# EAGLE design Projet Elec Groupe 8 (EAGLE 9.3.0)
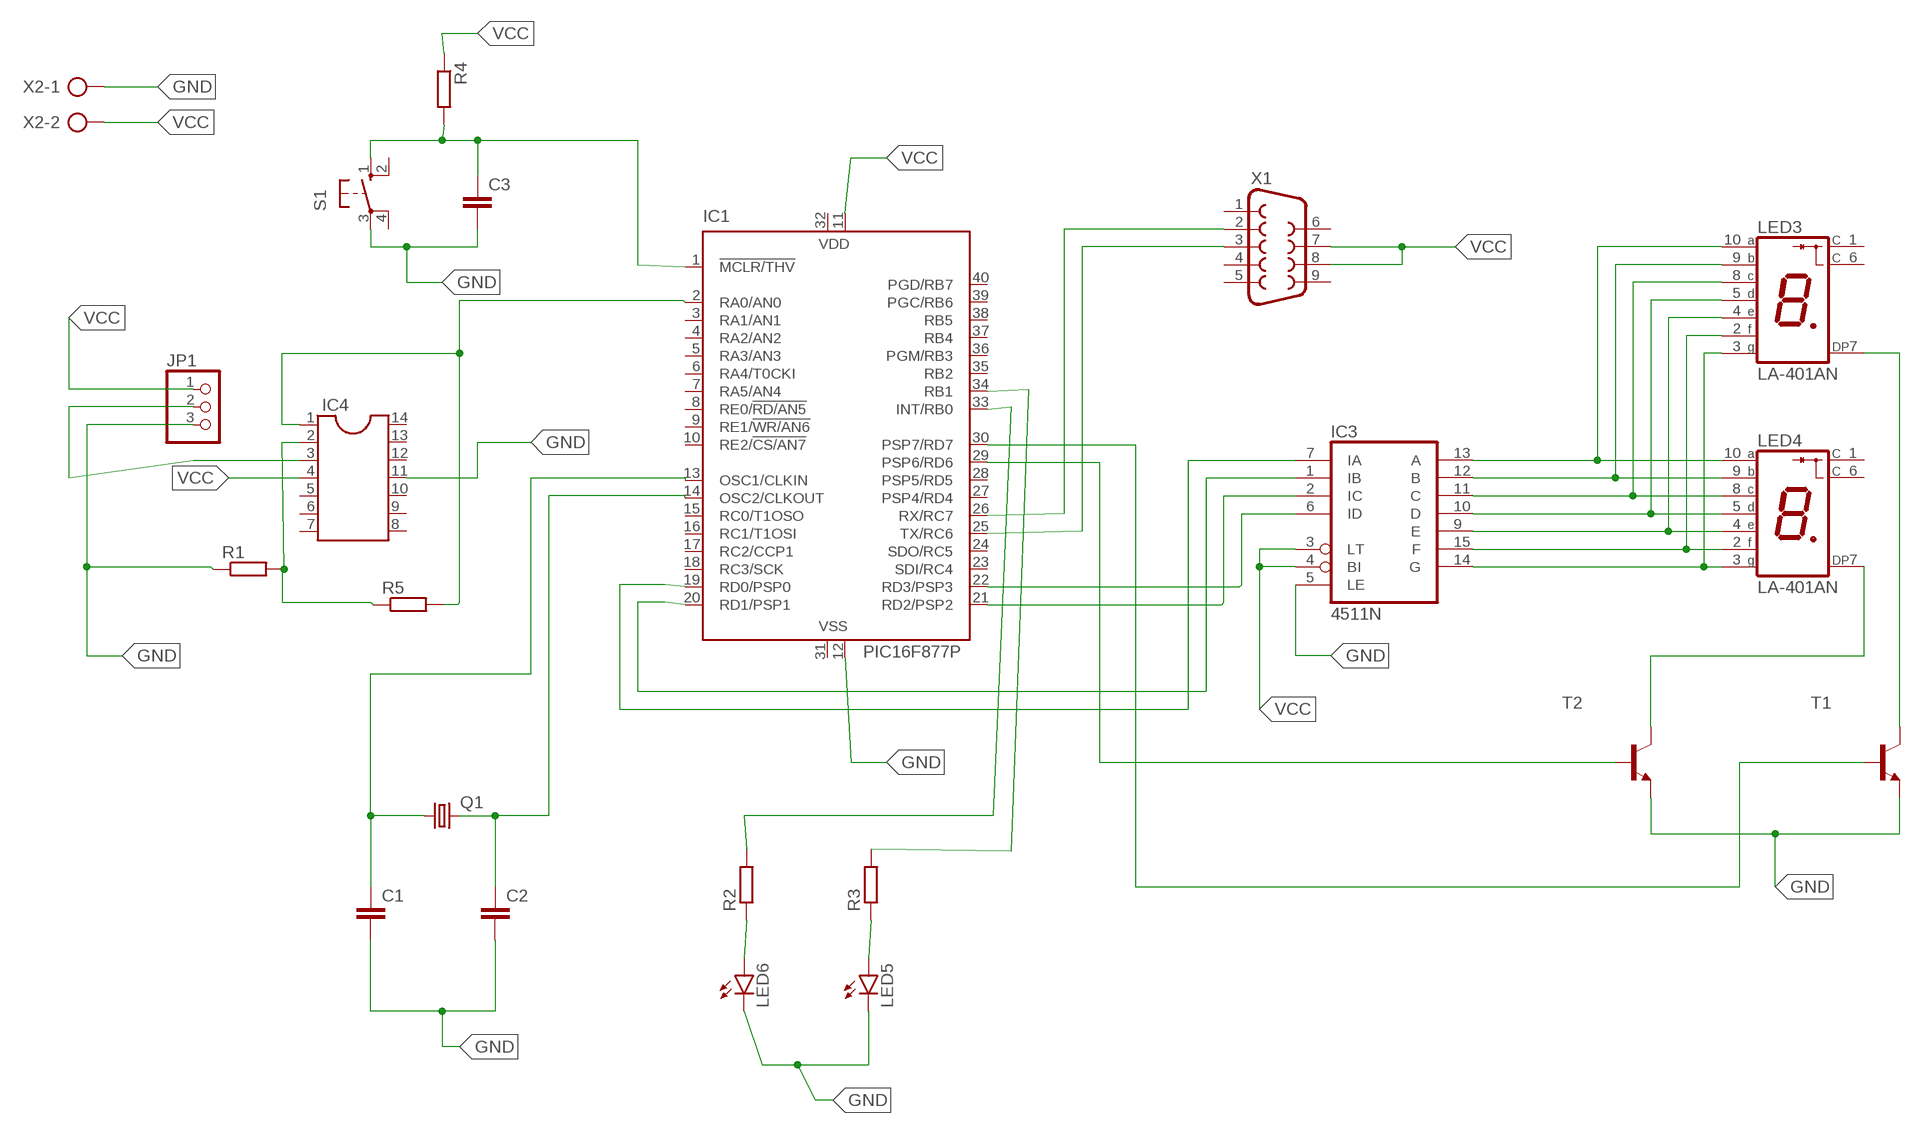
[diagram p0: schematic, sheet 1]

## Parts
C1  C-EU025-025X050  [C025-025X050]
C2  C-EU025-025X050  [C025-025X050]
C3  C-EU025-025X050  [C025-025X050]
IC1  PIC16F877P  [DIL40]
IC3  4511N  [DIL16]
IC4  DIL14  [DIL14]
JP1  PINHD-1X3  [1X03]
LED3  LA-401AN  [LA-401]
LED4  LA-401AN  [LA-401]
LED5  LEDLD260  [LD260]
LED6  LEDLD260  [LD260]
Q1  CRYSTALHC18U-V  [HC18U-V]
R1  R-EU_0204/5  [0204/5]
R2  R-EU_0204/5  [0204/5]
R3  R-EU_0204/5  [0204/5]
R4  R-EU_0204/5  [0204/5]
R5  R-EU_0204/5  [0204/5]
S1  10-XX  [B3F-10XX]
T1  -NPN-TO92-EBC  [TO92-EBC]
T2  -NPN-TO92-EBC  [TO92-EBC]
X1  F09V  [F09V]
X2  AK300/2  [AK300/2]

## Nets
GND: C1.2 C2.2 C3.2 IC1.12(VSS) IC3.5(LE) IC4.11 JP1.3 LED5.K(C) LED6.K(C) R1.1 S1.3(P) T1.E T2.E X2.1
N$1: IC1.30(PSP7/RD7) T1.B
N$2: IC1.29(PSP6/RD6) T2.B
N$3: IC3.13(A) LED3.10(A) LED4.10(A)
N$4: IC3.12(B) LED3.9(B) LED4.9(B)
N$5: IC3.11(C) LED3.8(C) LED4.8(C)
N$6: IC3.10(D) LED3.5(D) LED4.5(D)
N$7: IC3.9(E) LED3.4(E) LED4.4(E)
N$8: IC3.15(F) LED3.2(F) LED4.2(F)
N$9: IC3.14(G) LED3.3(G) LED4.3(G)
N$10: LED4.7(DP) T2.C
N$11: LED3.7(DP) T1.C
N$12: C1.1 IC1.13(OSC1/CLKIN) Q1.1
N$13: C2.1 IC1.14(OSC2/CLKOUT) Q1.2
N$14: LED6.A R2.1
N$15: LED5.A R3.1
N$16: IC1.26(RX/RC7) X1.2
N$17: IC1.19(RD0/PSP0) IC3.7(IA)
N$18: IC1.20(RD1/PSP1) IC3.1(IB)
N$19: IC1.21(RD2/PSP2) IC3.2(IC)
N$20: IC1.22(RD3/PSP3) IC3.6(ID)
N$21: C3.1 IC1.1(!MCLR/THV) R4.2 S1.1(S)
N$22: IC4.3 JP1.2
N$23: IC4.2 R1.2 R5.1
N$24: IC1.2(RA0/AN0) IC4.1 R5.2
N$25: IC1.25(TX/RC6) X1.3
N$26: IC1.33(INT/RB0) R2.2
N$27: IC1.34(RB1) R3.2
VCC: IC1.11(VDD) IC3.3(LT) IC3.4(BI) IC4.4 JP1.1 R4.1 X1.7 X1.8 X2.2
Unconnected: IC1.3(RA1/AN1) IC1.4(RA2/AN2) IC1.5(RA3/AN3) IC1.6(RA4/T0CKI) IC1.7(RA5/AN4) IC1.8(RE0/!RD/AN5) IC1.9(RE1/!WR/AN6) IC1.10(RE2/!CS/AN7) IC1.15(RC0/T1OSO) IC1.16(RC1/T1OSI) IC1.17(RC2/CCP1) IC1.18(RC3/SCK) IC1.23(SDI/RC4) IC1.24(SDO/RC5) IC1.27(PSP4/RD4) IC1.28(PSP5/RD5) IC1.35(RB2) IC1.36(PGM/RB3) IC1.37(RB4) IC1.38(RB5) IC1.39(PGC/RB6) IC1.40(PGD/RB7) IC4.5 IC4.6 IC4.7 IC4.8 IC4.9 IC4.10 IC4.12 IC4.13 IC4.14 LED3.1(C) LED3.6(C) LED4.1(C) LED4.6(C) S1.2(S1) S1.4(P1) X1.1 X1.4 X1.5 X1.6 X1.9

## Power pins joined to a net without a drawn wire
VDD: IC1.32(VDD) IC3.16(VDD)
VSS: IC1.31(VSS) IC3.8(VSS)

## Library data of the parts
C1-C3 = rcl:C-EU: CAPACITOR, European symbol; SPICEPREFIX: C
IC1 = microchip:PIC16F87*: MICROCONTROLLER; MF: MICROCHIP; MPN: PIC16F877-04/P; OC_FARNELL: 9761349; OC_NEWARK: 61K3463
IC3 = 45xx:4511: BCD to 7-segment LATCH/DECODER/DRIVER
IC4 = ic-package:DIL14: Dual In Line / Socket
JP1 = pinhead:PINHD-1X3: PIN HEADER
LED3 LED4 = led-7-segment:LA-401*N: Single Digit LED Numeric Display (cathode common) Source: ROHM .. la-1401dn.pdf; OC_FARNELL: unknown; OC_NEWARK: unknown
LED5 LED6 = led:LED: LED OSRAM: - CHIPLED LG R971, LG N971, LY N971, LG Q971, LY Q971, LO R971, LY R971 LH N974, LH R974 LS Q976, LO Q976, LY Q976 LO Q996 - Hyper CHIPLED LW Q18S LB Q993, LB Q99A, LB R99A - SideLED LS A670, LO A670, LY A670, LG A670, LP A670 LB A673, LV A673, LT A673, LW A673 LH A674 LY A675 LS A676, LA A676, LO A676, LY A676, LW A676 LS A679, LY A679, LG A679 - Hyper Micro SIDELED® LS Y876, LA Y876, LO Y876, LY Y876 LT Y87S - SmartLED LW L88C, LW L88S LB L89C, LB L89S, LG L890 LS L89K, LO L89K, LY L89K LS L896, LA L896, LO L896, LY L896 - TOPLED LS T670, LO T670, LY T670, LG T670, LP T670 LSG T670, LSP T670, LSY T670, LOP T670, LYG T670 LG T671, LOG T671, LSG T671 LB T673, LV T673, LT T673, LW T673 LH T674 LS T676, LA T676, LO T676, LY T676, LB T676, LH T676, LSB T676, LW T676 LB T67C, LV T67C, LT T67C, LS T67K, LO T67K, LY T67K, LW E67C LS E67B, LA E67B, LO E67B, LY E67B, LB E67C, LV E67C, LT E67C LW T67C LS T679, LY T679, LG T679 LS T770, LO T770, LY T770, LG T770, LP T770 LB T773, LV T773, LT T773, LW T773 LH T774 LS E675, LA E675, LY E675, LS T675 LS T776, LA T776, LO T776, LY T776, LB T776 LHGB T686 LT T68C, LB T68C - Hyper Mini TOPLED® LB M676 - Mini TOPLED Santana® LG M470 LS M47K, LO M47K, LY M47K Source: http://www.osram.convergy.de LUXEON: - LUMILED® LXK2-PW12-R00, LXK2-PW12-S00, LXK2-PW14-U00, LXK2-PW14-V00 LXK2-PM12-R00, LXK2-PM12-S00, LXK2-PM14-U00 LXK2-PE12-Q00, LXK2-PE12-R00, LXK2-PE12-S00, LXK2-PE14-T00, LXK2-PE14-U00 LXK2-PB12-K00, LXK2-PB12-L00, LXK2-PB12-M00, LXK2-PB14-N00, LXK2-PB14-P00, LXK2-PB14-Q00 LXK2-PR12-L00, LXK2-PR12-M00, LXK2-PR14-Q00, LXK2-PR14-R00 LXK2-PD12-Q00, LXK2-PD12-R00, LXK2-PD12-S00 LXK2-PH12-R00, LXK2-PH12-S00 LXK2-PL12-P00, LXK2-PL12-Q00, LXK2-PL12-R00 Source: www.luxeon.com KINGBRIGHT: KA-3528ASYC Source: www.kingbright.com
Q1 = crystal:CRYSTAL: CRYSTAL; OC_FARNELL: unknown; OC_NEWARK: unknown
R1-R5 = rcl:R-EU_: RESISTOR, European symbol; SPICEPREFIX: R
S1 = switch-omron:10-XX: OMRON SWITCH; MPN: B3F-1000; OC_FARNELL: 176432; OC_NEWARK: 36M3542
T1 T2 = transistor:*-NPN-: NPN Transistror BF959 corrected 2008.03.06
X1 = con-subd:F09: SUB-D; OC_FARNELL: unknown; OC_NEWARK: unknown
X2 = con-ptr500:AK300/2: CONNECTOR; OC_FARNELL: unknown; OC_NEWARK: unknown

## Board
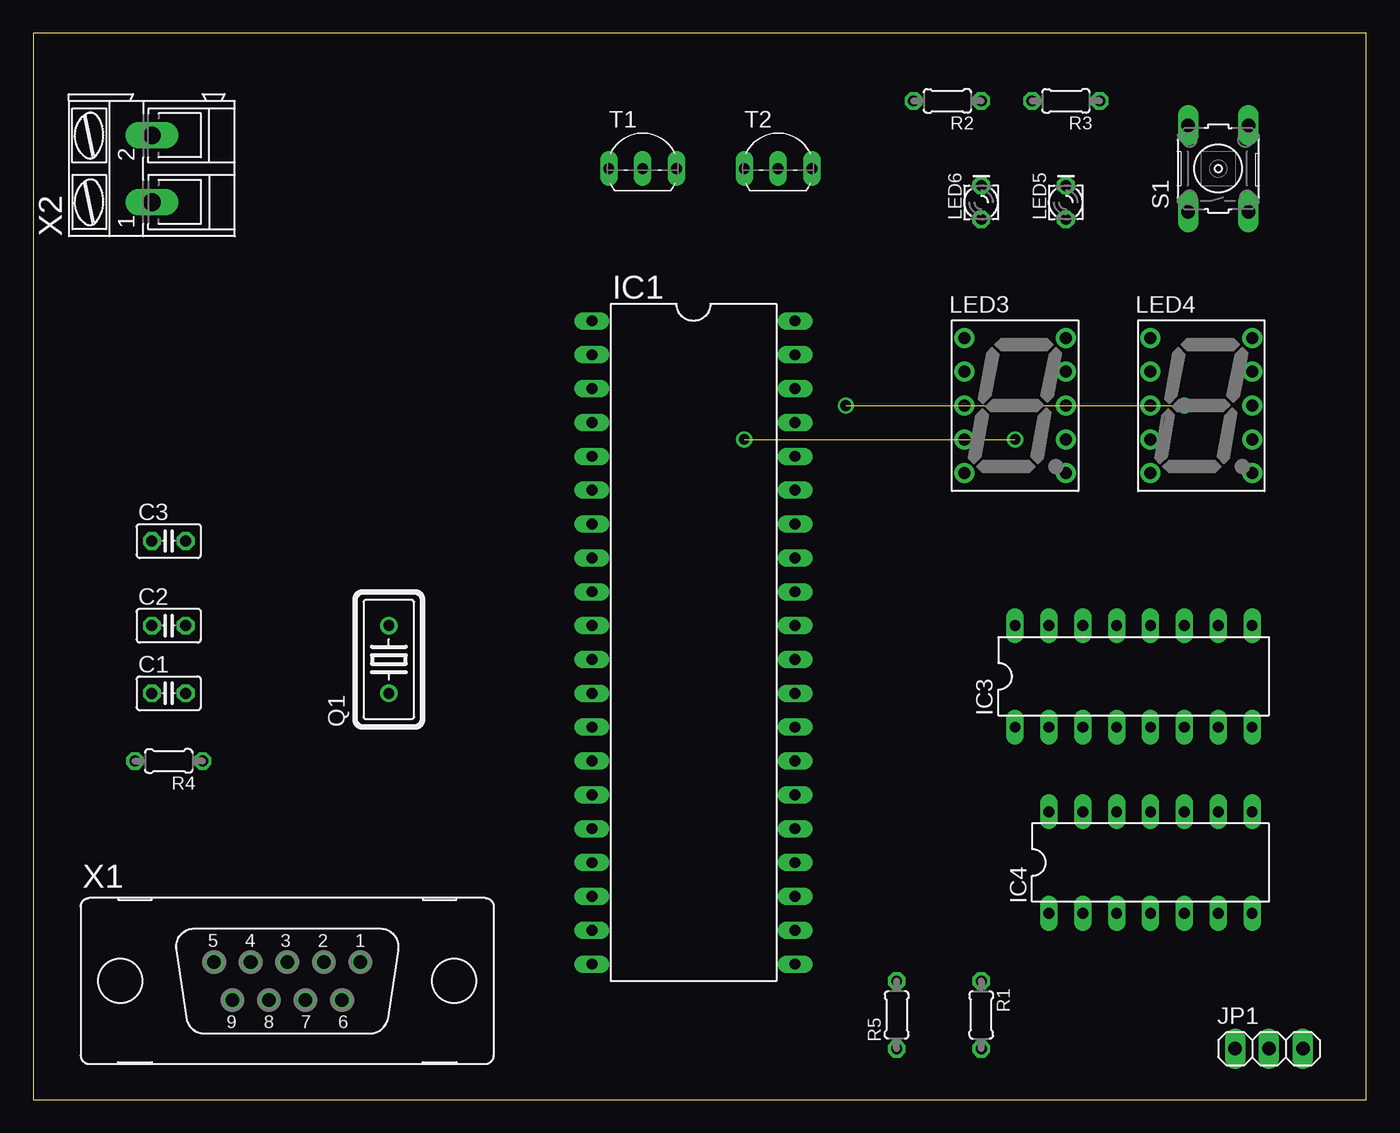
[diagram p1: board, top side]
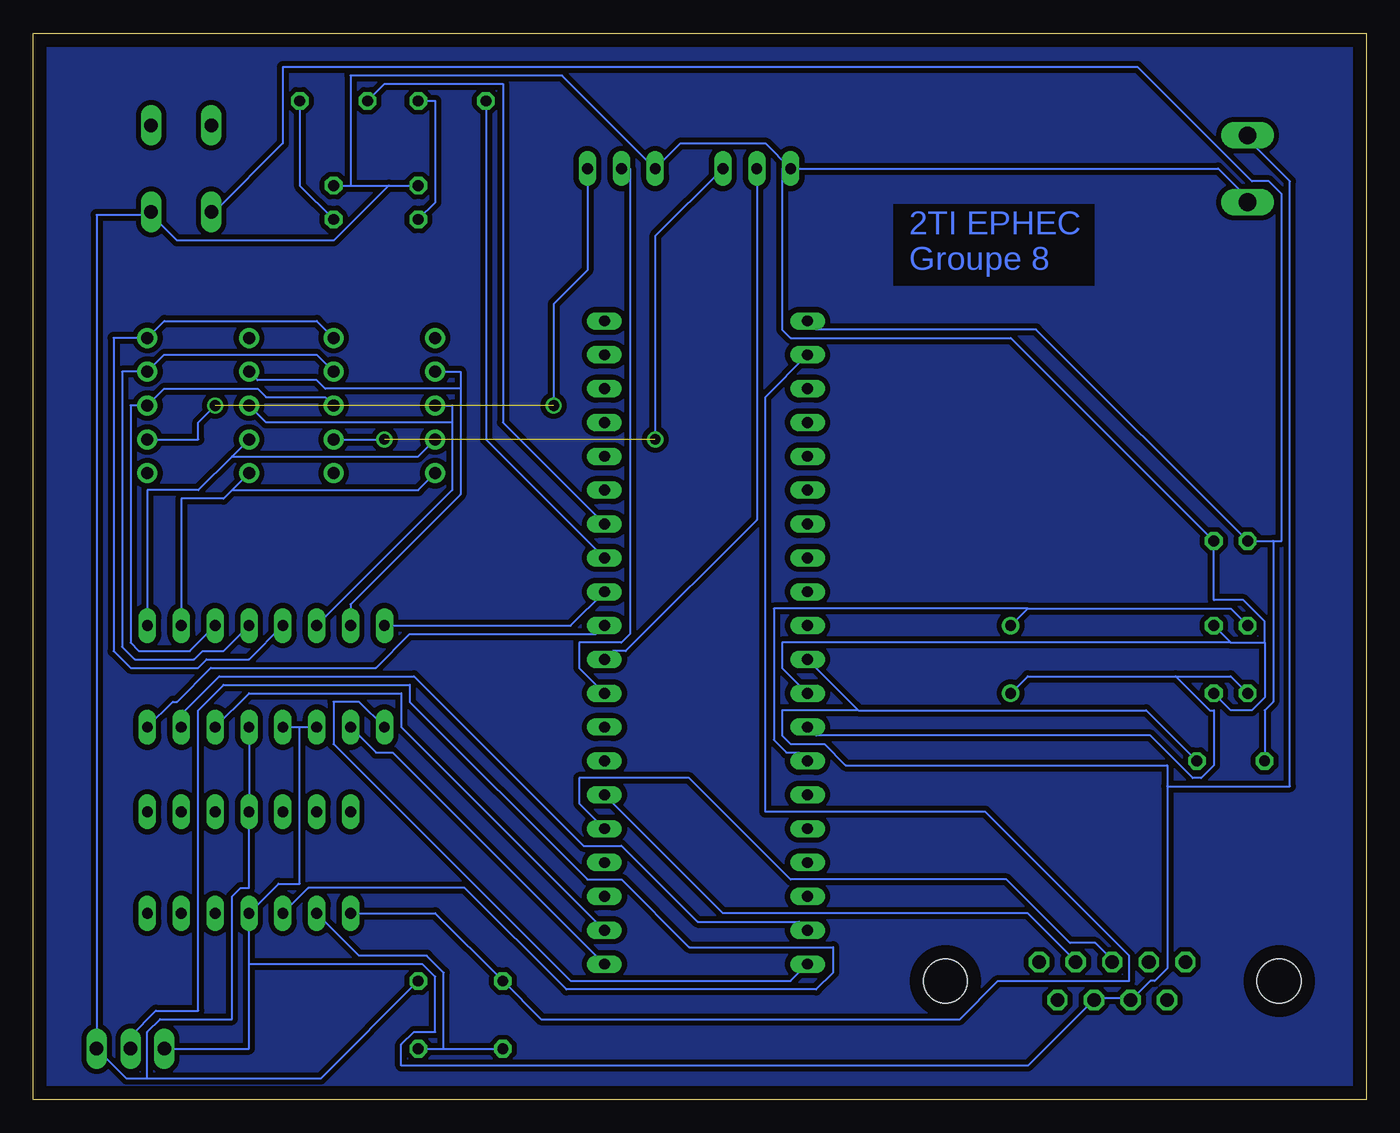
[diagram p2: board, bottom side, seen from below]

Size 100 x 80 mm. Coordinates in mm from the lower left corner, seen from the top.
Outline: 0,0 100,0 100,80 0,80 0,0
Copper layers (1*16): Top 0.035mm / dielectric 1.5mm / Bottom 0.035mm
Design rules "default *": minimum track width 6mil, minimum drill 0.35mm, track to track 15mil, track to pad 15mil, pad to pad 15mil, via to via 15mil, smd to smd 15mil, copper to edge 40mil, drill to drill 6mil, minimum pad ring 10mil, minimum via ring 8mil, stop-mask expansion 4mil, vias tented up to drill 0mil, thermal gap 10mil

### Footprints (pad centres in the part's own frame; a part is rotated, then mirrored left to right if it is on the bottom)
C025-025X050 = drill 0.813 octagon: 1 -1.27,0; 2 1.27,0
DIL40 = drill 0.813 long: 1 -24.13,-7.62; 2 -21.59,-7.62; 3 -19.05,-7.62; 4 -16.51,-7.62; 5 -13.97,-7.62; 6 -11.43,-7.62; 7 -8.89,-7.62; 8 -6.35,-7.62; 9 -3.81,-7.62; 10 -1.27,-7.62; 11 1.27,-7.62; 12 3.81,-7.62; 13 6.35,-7.62; 14 8.89,-7.62; 15 11.43,-7.62; 16 13.97,-7.62; 17 16.51,-7.62; 18 19.05,-7.62; 19 21.59,-7.62; 20 24.13,-7.62; 21 24.13,7.62; 22 21.59,7.62; 23 19.05,7.62; 24 16.51,7.62; 25 13.97,7.62; 26 11.43,7.62; 27 8.89,7.62; 28 6.35,7.62; 29 3.81,7.62; 30 1.27,7.62; 31 -1.27,7.62; 32 -3.81,7.62; 33 -6.35,7.62; 34 -8.89,7.62; 35 -11.43,7.62; 36 -13.97,7.62; 37 -16.51,7.62; 38 -19.05,7.62; 39 -21.59,7.62; 40 -24.13,7.62
DIL16 = drill 0.813 long: 1 -8.89,-3.81; 2 -6.35,-3.81; 3 -3.81,-3.81; 4 -1.27,-3.81; 5 1.27,-3.81; 6 3.81,-3.81; 7 6.35,-3.81; 8 8.89,-3.81; 9 8.89,3.81; 10 6.35,3.81; 11 3.81,3.81; 12 1.27,3.81; 13 -1.27,3.81; 14 -3.81,3.81; 15 -6.35,3.81; 16 -8.89,3.81
DIL14 = drill 0.813 long: 1 -7.62,-3.81; 2 -5.08,-3.81; 3 -2.54,-3.81; 4 0,-3.81; 5 2.54,-3.81; 6 5.08,-3.81; 7 7.62,-3.81; 8 7.62,3.81; 9 5.08,3.81; 10 2.54,3.81; 11 0,3.81; 12 -2.54,3.81; 13 -5.08,3.81; 14 -7.62,3.81
1X03 = drill 1.016 long: 1 -2.54,0; 2 0,0; 3 2.54,0
LA-401 = drill 0.9 pad 1.5: 1 -3.81,5.08; 2 -3.81,2.54; 3 -3.81,0; 4 -3.81,-2.54; 5 -3.81,-5.08; 6 3.81,-5.08; 7 3.81,-2.54; 8 3.81,0; 9 3.81,2.54; 10 3.81,5.08
LD260 = drill 0.813 octagon: A -1.27,0; K 1.27,0
HC18U-V = drill 0.813: 1 -2.54,0; 2 2.54,0
0204/5 = drill 0.813 octagon: 1 -2.54,0; 2 2.54,0
B3F-10XX = drill 1.016 long: 1 -3.251,2.261; 2 3.251,2.261; 3 -3.251,-2.261; 4 3.251,-2.261
TO92-EBC = drill 0.813 long: B 0,-1.27; C 2.54,-1.27; E -2.54,-1.27
F09V = drill 1.016 octagon: 1 5.486,1.422; 2 2.743,1.422; 3 0,1.422; 4 -2.743,1.422; 5 -5.486,1.422; 6 4.115,-1.422; 7 1.372,-1.422; 8 -1.372,-1.422; 9 -4.115,-1.422 | hole 3.302: -12.522,0; 12.522,0
AK300/2 = drill 1.321 long: 1 -2.515,0; 2 2.489,0

### Placement (x,y rotation side)
C1  10.16,30.48 0 top
C2  10.16,35.56 0 top
C3  10.16,41.91 0 top
IC1  49.53,34.29 270 top
IC3  82.55,31.75 0 top
IC4  83.82,17.78 0 top
JP1  92.71,3.81 0 top
LED3  73.66,52.07 0 top
LED4  87.63,52.07 0 top
LED5  77.47,67.31 90 top
LED6  71.12,67.31 90 top
Q1  26.67,33.02 90 top
R1  71.12,6.35 270 top
R2  68.58,74.93 180 top
R3  77.47,74.93 180 top
R4  10.16,25.4 180 top
R5  64.77,6.35 90 top
S1  88.9,69.85 90 top
T1  45.72,71.12 0 top
T2  55.88,71.12 0 top
X1  19.05,8.89 0 top
X2  8.89,69.85 90 top

### Tracks (layer width: path | path; a pad name or v marks a point on that pad's centre or on a via)
A
  pour Bottom: 0,80.01 100.33,80.01 100.33,0 38.1,0 38.1,67.31 0,67.31
  pour Bottom: 0,67.31 20.32,67.31 20.32,60.96 35.56,60.96 35.56,67.31 38.1,67.31 38.1,0 0,0
GND
  Bottom 0.152: IC3.5 IC4.11 83.82,15.88 84.45,15.88 85.09,15.24 85.09,6.03 90.49,6.03 91.44,5.08 91.44,1.59 | R1.1 78.42,1.59 91.44,1.59 | 91.44,1.59 93.03,1.59 JP1.3 95.25,66.36 91.44,66.36 S1.3 91.12,66.36 89.22,64.45 77.47,64.45 73.34,68.58 | C1.2 10.16,29.21 8.57,29.21 7.62,30.16 7.62,34.29 | 10.16,34.29 7.62,34.29 | C2.2 10.16,34.29 | 7.62,34.29 7.62,35.88 9.21,37.47 11.43,37.47 C3.2 26.67,57.15 43.18,57.15 43.81,57.78 43.81,69.85 T1.E | IC1.12 43.81,32.38 43.81,34.29 10.16,34.29 | LED5.K 76.2,68.58 | 76.2,68.58 73.34,68.58 | 73.34,68.58 LED6.K | T1.E 45.09,71.75 51.44,71.75 T2.E 60.33,76.83 76.2,76.83 76.2,68.58 | T1.E 11.11,69.85 8.89,67.63 X2.1
N$1
  Bottom 0.152: IC1.30 56.52,33.66 55.56,33.66 45.72,43.5 T1.B
N$2
  Bottom 0.152: IC1.29 59.05,32.38 59.05,34.29 55.88,34.29 55.24,34.92 55.24,69.85 T2.B
N$3
  Bottom 0.152: IC3.13 83.82,33.02 87,33.02 87.63,32.38 92.71,32.38 93.98,33.66 93.98,57.15 LED4.10 90.17,58.42 78.74,58.42 LED3.10
N$4
  Bottom 0.152: IC3.12 85.72,33.66 87.31,33.66 87.95,33.02 92.39,33.02 93.34,33.97 93.34,54.61 LED4.9 90.17,55.88 78.74,55.88 LED3.9
N$5
  Bottom 0.152: IC3.11 88.27,33.66 92.08,33.66 92.71,34.29 92.71,52.07 LED4.8 90.17,53.34 83.19,53.34 82.55,52.7 78.11,52.7 LED3.8
N$6
  Bottom 0.152: IC3.10 88.9,45.09 85.72,45.09 85.09,45.72 | LED4.5 85.09,45.72 | LED3.5 71.12,45.72 85.09,45.72
N$7
  Bottom 0.152: IC3.9 91.44,45.72 87.63,45.72 85.09,48.26 | LED4.4 85.09,48.26 | LED3.4 71.12,48.26 85.09,48.26
N$8
  Bottom 0.152: IC3.15 76.2,37.15 67.94,45.4 67.94,53.34 | 67.94,53.34 67.94,54.61 LED3.2 | LED4.2 83.19,53.98 78.74,53.98 78.11,53.34 67.94,53.34
N$9
  Bottom 0.152: IC3.14 68.58,45.72 68.58,50.8 | 68.58,50.8 68.58,52.07 LED3.3 | LED4.3 82.55,50.8 68.58,50.8
N$10  (via drill 0.4, 0.8)  (1 unrouted)
  Bottom 0.152: LED4.7 87.63,49.53 87.63,50.8 v86.36,52.07 | T2.C 58.42,62.23 60.96,59.69 v60.96,52.07
N$11  (via drill 0.4, 0.8)  (1 unrouted)
  Bottom 0.152: T1.C 53.34,64.77 v53.34,49.53 | LED3.7 v73.66,49.53
N$12
  Bottom 0.152: C1.1 10.16,31.75 14.29,31.75 | 14.29,31.75 25.4,31.75 Q1.1 | IC1.13 41.27,27.3 16.19,27.3 13.02,24.13 12.38,24.13 11.43,25.08 11.43,29.21 11.75,29.21 14.29,31.75
N$13
  Bottom 0.152: C2.1 10.16,36.83 25.4,36.83 | Q1.2 25.4,36.83 | IC1.14 42.55,26.04 43.5,26.04 44.45,26.99 44.45,36.83 25.4,36.83
N$14
  Bottom 0.152: LED6.A 69.85,67.31 69.85,74.93 R2.1
N$15
  Bottom 0.152: LED5.A 80.01,68.58 R3.1
N$16
  Bottom 0.152: IC1.26 48.26,13.97 25.4,13.97 21.91,10.48 X1.2
N$17
  Bottom 0.152: IC1.19 42.55,13.34 50.16,13.34 55.88,19.05 58.74,19.05 71.44,31.75 86.04,31.75 88.9,28.89 IC3.7
N$18
  Bottom 0.152: IC1.20 43.18,8.89 59.69,8.89 77.47,26.67 77.47,29.84 75.56,29.84 IC3.1
N$19
  Bottom 0.152: IC1.21 73.03,26.04 74.3,26.04 IC3.2
N$20
  Bottom 0.152: IC1.22 72.39,27.94 72.39,30.48 83.82,30.48 IC3.6
N$21
  Bottom 0.152: R4.2 7.62,29.21 6.99,29.84 6.99,41.91 | 6.99,41.91 C3.1 24.77,57.78 41.27,57.78 IC1.1 | 6.99,41.91 6.35,41.91 6.35,67.94 7.3,68.9 8.57,68.9 17.14,77.47 81.28,77.47 81.28,71.75 86.36,66.67 S1.1
N$22
  Bottom 0.152: IC4.3 79.38,15.88 67.63,15.88 60.01,8.26 41.27,8.26 40.01,9.53 40.01,11.43 50.8,11.43 55.88,16.51 58.42,16.51 71.75,29.84 71.75,31.11 85.72,31.11 87.63,29.21 87.63,6.67 90.81,6.67 92.71,4.76 JP1.2
N$23
  Bottom 0.152: R1.2 69.22,3.81 | 69.22,3.81 R5.1 | IC4.2 75.56,10.79 70.48,10.79 69.22,9.53 69.22,3.81
N$24
  Bottom 0.152: IC4.1 69.85,13.97 R5.2 61.91,6.03 30.48,6.03 27.62,8.89 17.78,8.89 17.78,10.79 28.57,21.59 45.09,21.59 45.09,52.7 IC1.2
N$25
  Bottom 0.152: IC1.25 59.05,22.23 59.05,24.13 50.8,24.13 43.18,16.51 26.99,16.51 22.23,11.75 20.32,11.75 19.05,10.48 X1.3
N$26
  Bottom 0.152: IC1.33 66.04,49.53 R2.2
N$27
  Bottom 0.152: IC1.34 64.77,50.8 64.77,76.2 73.66,76.2 R3.2
VCC
  Bottom 0.152: IC3.4 80.01,27.94 | 80.01,27.94 IC3.3 | 83.82,10.16 83.82,3.81 JP1.1 | 83.82,10.16 IC4.4 81.6,16.19 80.01,16.19 80.01,27.94 | R4.1 16.51,29.21 38.1,29.21 | IC1.11 38.1,29.21 | 14.92,23.5 14.92,25.08 39.05,25.08 40.64,26.67 43.18,26.67 43.81,27.3 43.81,29.21 38.1,29.21 | 14.92,23.5 14.92,9.84 15.88,8.89 16.19,8.89 17.46,7.62 X1.8 17.78,7.62 20.32,7.62 X1.7 20.64,7.3 25.4,2.54 72.39,2.54 72.39,4.13 71.44,5.08 69.85,5.08 69.85,9.21 70.8,10.16 83.82,10.16 | 14.92,23.5 5.71,23.5 5.71,68.9 8.89,72.07 X2.2
VDD
  Bottom 0.152: IC1.32 59.69,35.56 IC3.16
VSS
  Bottom 0.152: IC1.31 57.78,34.92 71.75,34.92 74.3,32.38 86.68,32.38 89.22,29.84 89.53,29.84 IC3.8

### Text on the board
Bottom: 2TI EPHEC / Groupe 8